# EAGLE design tester (EAGLE 6.2)
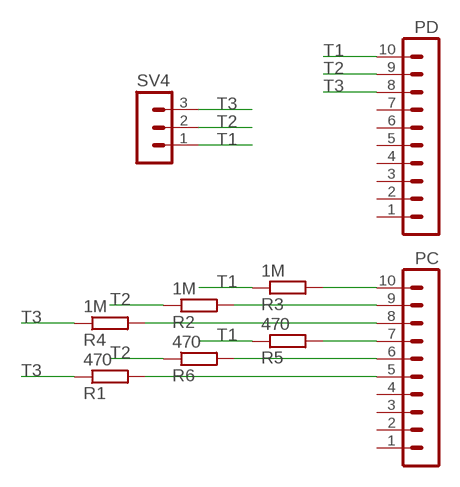
[diagram p0: schematic, sheet 1]

## Parts
PC  MA10-1W  [MA10-1W]
PD  MA10-1W  [MA10-1W]
R1  470  R-EU_R1206  [R1206]
R2  1M  R-EU_R1206  [R1206]
R3  1M  R-EU_R1206  [R1206]
R4  1M  R-EU_R1206  [R1206]
R5  470  R-EU_R1206  [R1206]
R6  470  R-EU_R1206  [R1206]
SV4  MA03-1  [MA03-1]

## Nets
N$1: PC.10 R3.2
N$2: PC.9 R2.2
N$3: PC.8 R4.2
N$4: PC.7 R5.2
N$5: PC.6 R6.2
N$6: PC.5 R1.2
T1: PD.10 R3.1 R5.1 SV4.1
T2: PD.9 R2.1 R6.1 SV4.2
T3: PD.8 R1.1 R4.1 SV4.3
Unconnected: PC.1 PC.2 PC.3 PC.4 PD.1 PD.2 PD.3 PD.4 PD.5 PD.6 PD.7

## Library data of the parts
PC PD = con-lstb:MA10-1W: PIN HEADER
R1-R6 = rcl:R-EU_: RESISTOR, European symbol
SV4 = con-lstb:MA03-1: PIN HEADER

## Board
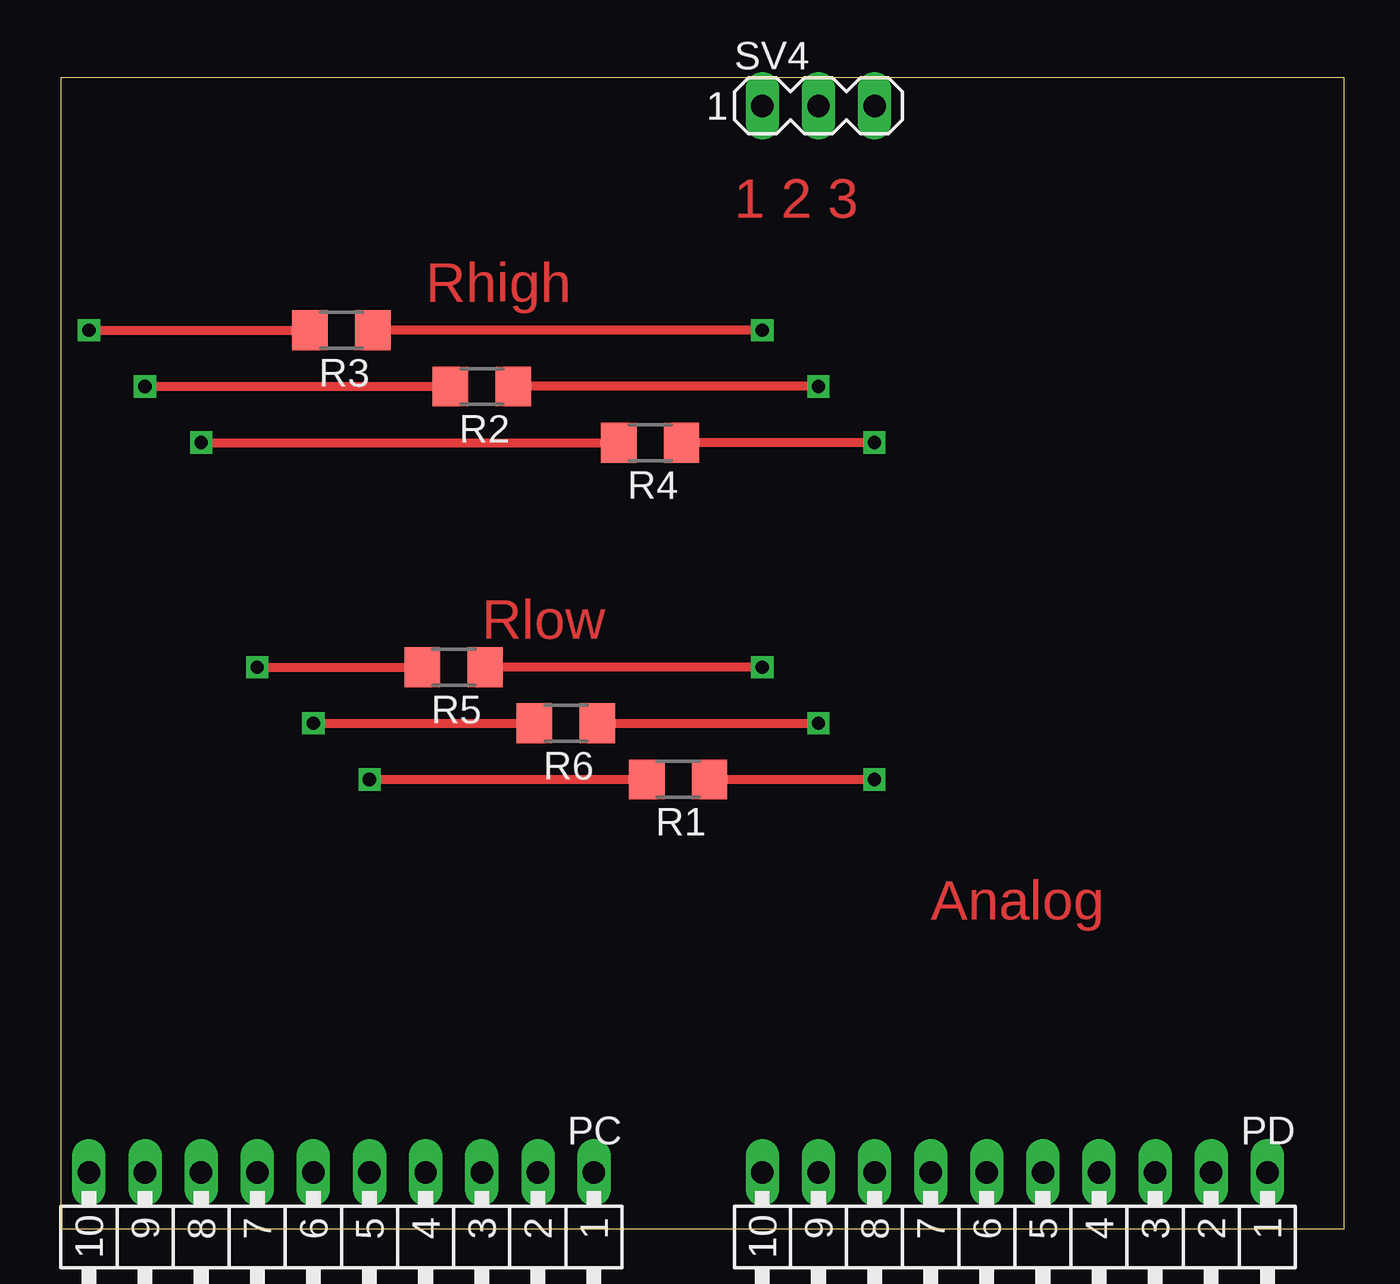
[diagram p1: board, top side]
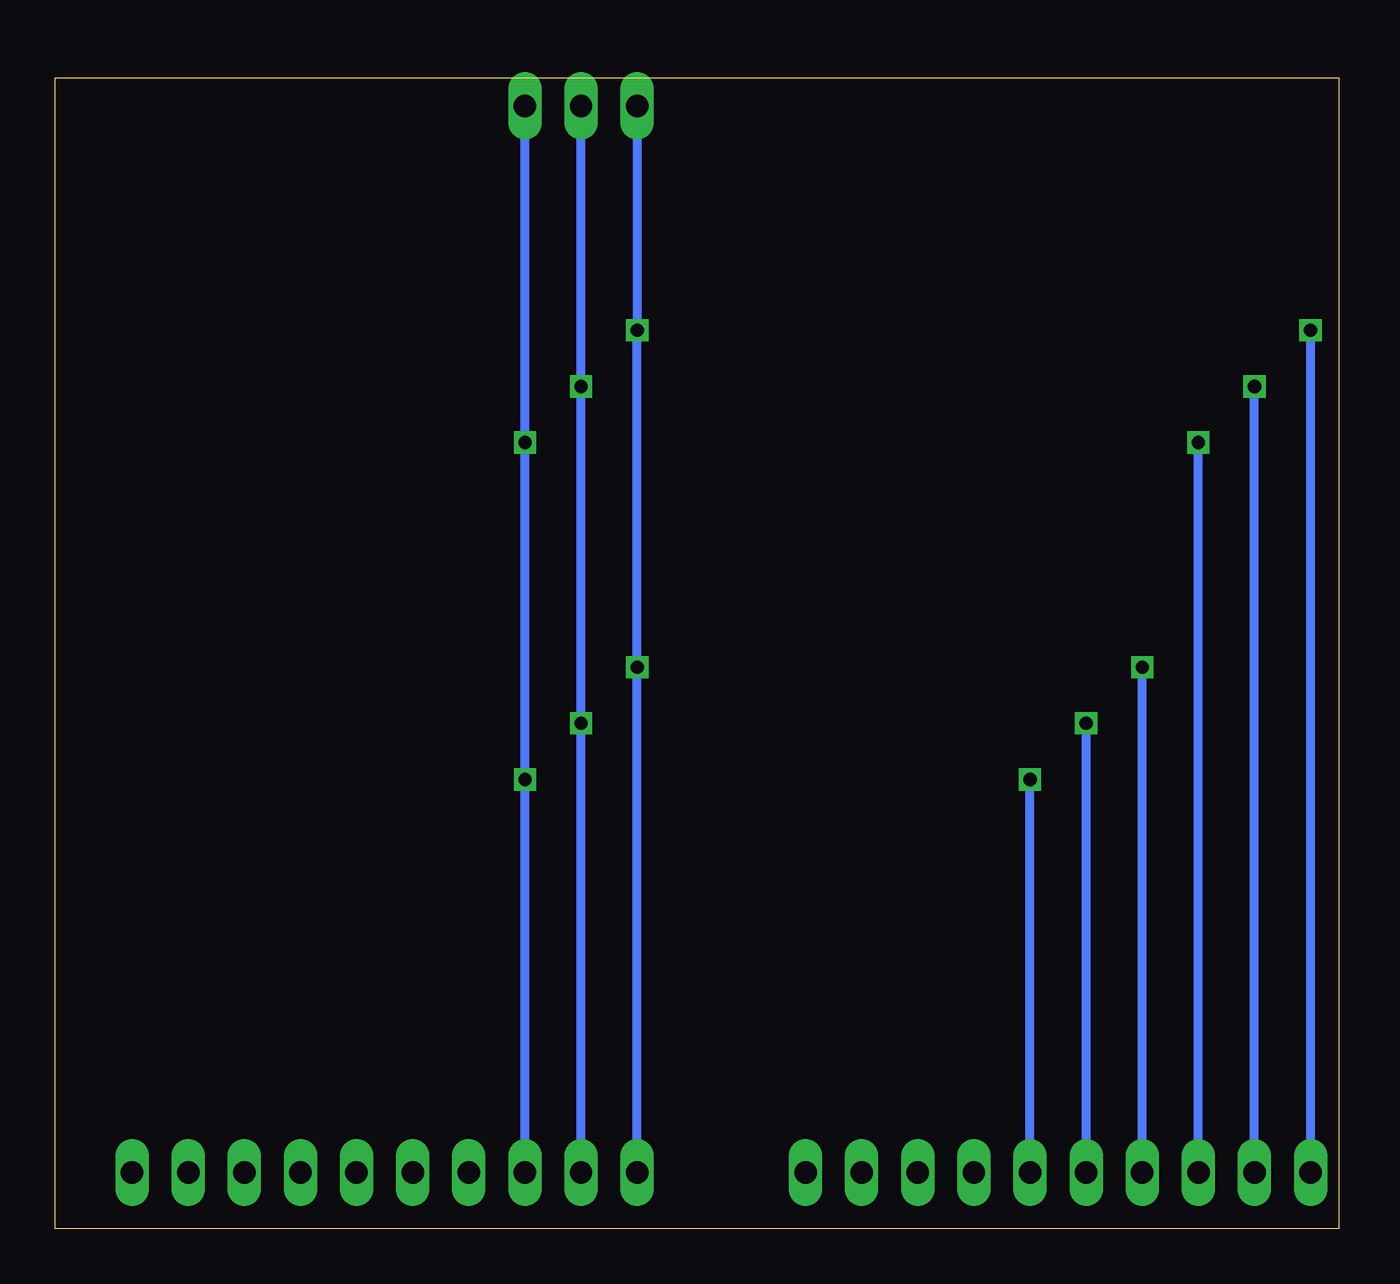
[diagram p2: board, bottom side, seen from below]

Size 58.09 x 52.06 mm. Coordinates in mm from the lower left corner, seen from the top.
Outline: 0,0 58.09,0 58.09,52.06 0,52.06 0,0
Copper layers (1*16): Top 0.035mm / dielectric 1.5mm / Bottom 0.035mm
Design rules: minimum track width 10mil, minimum drill 24mil, track to track 8mil, track to pad 8mil, pad to pad 8mil, via to via 8mil, smd to smd 8mil, copper to edge 40mil, drill to drill 8mil, minimum pad ring 10mil, minimum via ring 8mil, stop-mask expansion 4mil, vias tented up to drill 0mil, thermal gap 10mil

### Footprints (pad centres in the part's own frame; a part is rotated, then mirrored left to right if it is on the bottom)
MA10-1W = drill 1.016 long: 1 -11.43,0; 2 -8.89,0; 3 -6.35,0; 4 -3.81,0; 5 -1.27,0; 6 1.27,0; 7 3.81,0; 8 6.35,0; 9 8.89,0; 10 11.43,0
R1206 = smd 1.6 x 1.803: 1 -1.422,0; 2 1.422,0
MA03-1 = drill 1.016 long: 1 -2.54,0; 2 0,0; 3 2.54,0

### Placement (x,y rotation side)
PC  12.7,2.54 180 top
PD  43.18,2.54 180 top
R1  27.94,20.32 180 top
R2  19.05,38.1 180 top
R3  12.7,40.64 180 top
R4  26.67,35.56 180 top
R5  17.78,25.4 180 top
R6  22.86,22.86 180 top
SV4  34.29,50.8 0 top

### Tracks (layer width: path | path; a pad name or v marks a point on that pad's centre or on a via)
N$1  (via drill 0.6)
  Top 0.406: v1.27,40.64 R3.2
  Bottom 0.406: PC.10 v1.27,40.64
N$2  (via drill 0.6)
  Top 0.406: v3.81,38.1 R2.2
  Bottom 0.406: PC.9 v3.81,38.1
N$3  (via drill 0.6)
  Top 0.406: v6.35,35.56 R4.2
  Bottom 0.406: PC.8 v6.35,35.56
N$4  (via drill 0.6)
  Top 0.406: v8.89,25.4 R5.2
  Bottom 0.406: PC.7 v8.89,25.4
N$5  (via drill 0.6)
  Top 0.406: v11.43,22.86 R6.2
  Bottom 0.406: PC.6 v11.43,22.86
N$6  (via drill 0.6)
  Top 0.406: v13.97,20.32 R1.2
  Bottom 0.406: PC.5 v13.97,20.32
T1  (via drill 0.6)
  Top 0.406: v31.75,40.64 R3.1 | v31.75,25.4 R5.1
  Bottom 0.406: PD.10 v31.75,25.4 v31.75,40.64 SV4.1
T2  (via drill 0.6)
  Top 0.406: v34.29,38.1 R2.1 | R6.1 v34.29,22.86
  Bottom 0.406: PD.9 v34.29,22.86 v34.29,38.1 SV4.2
T3  (via drill 0.6)
  Top 0.406: v36.83,35.56 R4.1 | R1.1 v36.83,20.32
  Bottom 0.406: PD.8 v36.83,20.32 v36.83,35.56 SV4.3

### Text on the board
Top: 1 2 3 | Rhigh | Rlow | Analog